# EAGLE design CS_OBC (EAGLE 9.5.0)
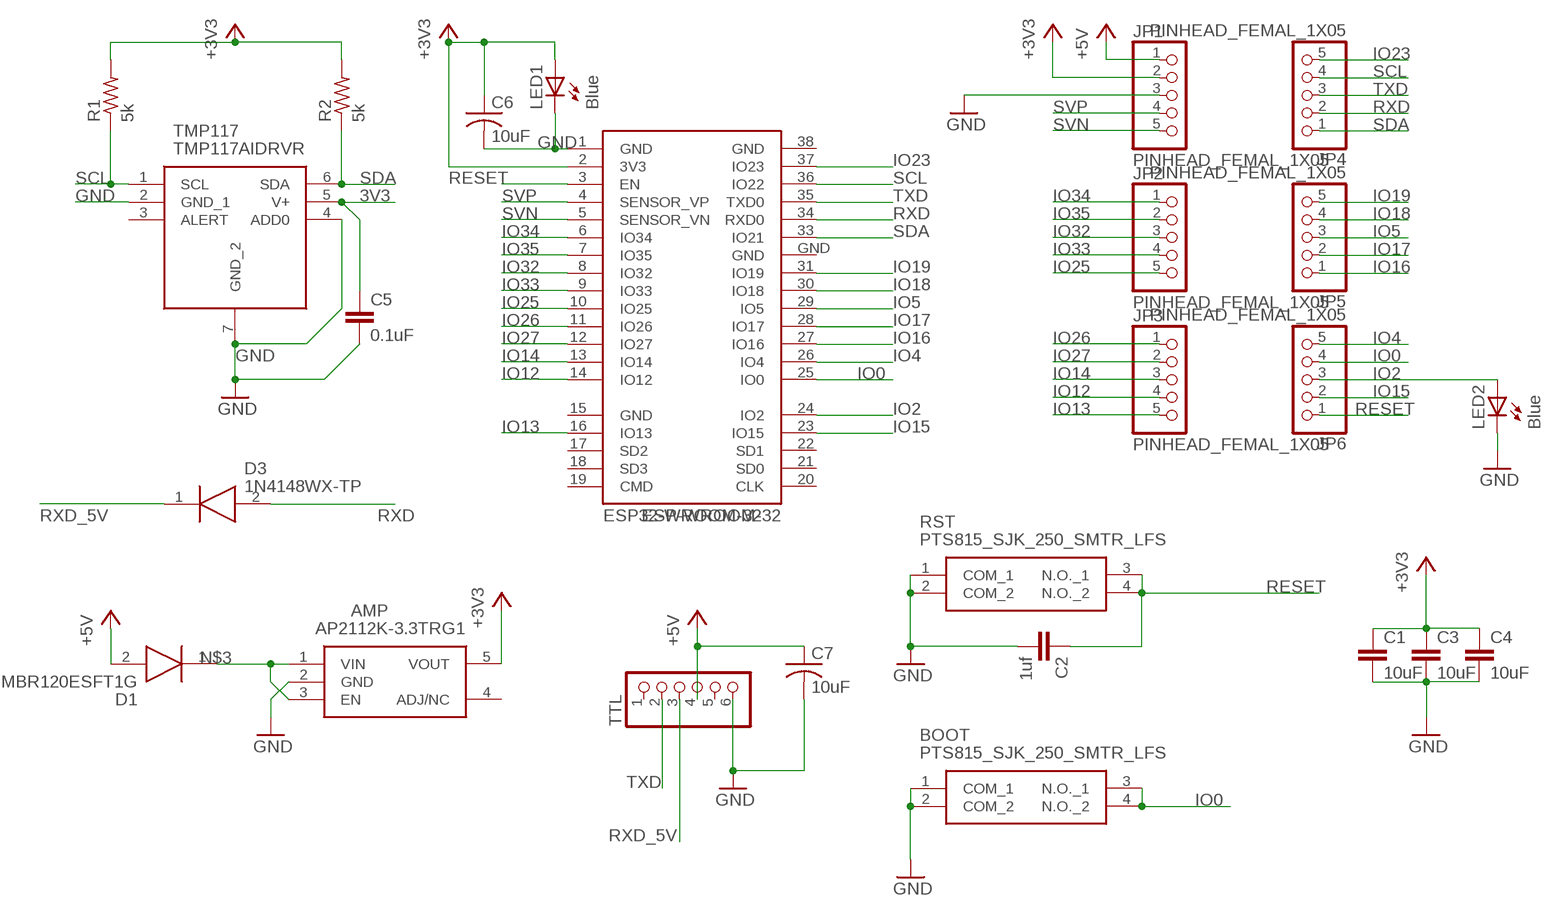
[diagram p0: schematic, sheet 1]

## Parts
AMP  AP2112K-3.3TRG1  [SOT95P282X130-5N]
BOOT  PTS815_SJK_250_SMTR_LFS  [PTS815SJK250SMTRLFS]
C1  10uF  C-EUC0805  [C0805]
C2  1uf  C-EUC0805  [C0805]
C3  10uF  C-EUC0805  [C0805]
C4  10uF  C-EUC0805  [C0805]
C5  0.1uF  C-EUC0805  [C0805]
C6  10uF  C-USC1206  [C1206]
C7  10uF  C-USC1206  [C1206]
D1  MBR120ESFT1G  [SODFL3616X98N]
D3  1N4148WX-TP  [SOD2512X115N]
ESP32-WROOM-32  ESP-WROOM-32  [ESP-WROOM-32]
JP1  PINHEAD_FEMAL_1X05  [1X05F]
JP2  PINHEAD_FEMAL_1X05  [1X05F]
JP3  PINHEAD_FEMAL_1X05  [1X05F]
JP4  PINHEAD_FEMAL_1X05  [1X05F]
JP5  PINHEAD_FEMAL_1X05  [1X05F]
JP6  PINHEAD_FEMAL_1X05  [1X05F]
LED1  Blue  LEDCHIPLED_0805  [CHIPLED_0805]
LED2  Blue  LEDCHIPLED_0805  [CHIPLED_0805]
R1  5k  R-US_R0805  [R0805]
R2  5k  R-US_R0805  [R0805]
RST  PTS815_SJK_250_SMTR_LFS  [PTS815SJK250SMTRLFS]
TMP117  TMP117AIDRVR  [SON65P200X200X80-7N]
TTL  PINHD-1X6/90  [1X06/90]

## Nets
3V3: C5.1 TMP117.5(V+)
+3V3: AMP.5(VOUT) C1.1 C3.1 C4.1 C6.1 ESP32-WROOM-32.2(3V3) JP1.2 LED1.A R1.2 R2.2
+5V: C7.1 D1.2(A) JP1.1 TTL.4
GND: AMP.2(GND) BOOT.1(COM_1) BOOT.2(COM_2) C1.2 C2.2 C3.2 C4.2 C5.2 C6.2 C7.2 ESP32-WROOM-32.1(GND) JP1.3 LED1.C LED2.C RST.1(COM_1) RST.2(COM_2) TMP117.2(GND_1) TMP117.4(ADD0) TMP117.7(GND_2) TTL.6
IO0: BOOT.3(N.O._1) BOOT.4(N.O._2) ESP32-WROOM-32.25(IO0) JP6.4
IO2: ESP32-WROOM-32.24(IO2) JP6.3 LED2.A
IO4: ESP32-WROOM-32.26(IO4) JP6.5
IO5: ESP32-WROOM-32.29(IO5) JP5.3
IO12: ESP32-WROOM-32.14(IO12) JP3.4
IO13: ESP32-WROOM-32.16(IO13) JP3.5
IO14: ESP32-WROOM-32.13(IO14) JP3.3
IO15: ESP32-WROOM-32.23(IO15) JP6.2
IO16: ESP32-WROOM-32.27(IO16) JP5.1
IO17: ESP32-WROOM-32.28(IO17) JP5.2
IO18: ESP32-WROOM-32.30(IO18) JP5.4
IO19: ESP32-WROOM-32.31(IO19) JP5.5
IO23: ESP32-WROOM-32.37(IO23) JP4.5
IO25: ESP32-WROOM-32.10(IO25) JP2.5
IO26: ESP32-WROOM-32.11(IO26) JP3.1
IO27: ESP32-WROOM-32.12(IO27) JP3.2
IO32: ESP32-WROOM-32.8(IO32) JP2.3
IO33: ESP32-WROOM-32.9(IO33) JP2.4
IO34: ESP32-WROOM-32.6(IO34) JP2.1
IO35: ESP32-WROOM-32.7(IO35) JP2.2
N$3: AMP.1(VIN) AMP.3(EN) D1.1(K)
RESET: C2.1 ESP32-WROOM-32.3(EN) JP6.1 RST.3(N.O._1) RST.4(N.O._2)
RXD: D3.2(A) ESP32-WROOM-32.34(RXD0) JP4.2
RXD_5V: D3.1(K) TTL.3
SCL: ESP32-WROOM-32.36(IO22) JP4.4 R1.1 TMP117.1(SCL)
SDA: ESP32-WROOM-32.33(IO21) JP4.1 R2.1 TMP117.6(SDA)
SVN: ESP32-WROOM-32.5(SENSOR_VN) JP1.5
SVP: ESP32-WROOM-32.4(SENSOR_VP) JP1.4
TXD: ESP32-WROOM-32.35(TXD0) JP4.3 TTL.2
Unconnected: AMP.4(ADJ/NC) ESP32-WROOM-32.17(SD2) ESP32-WROOM-32.18(SD3) ESP32-WROOM-32.19(CMD) ESP32-WROOM-32.20(CLK) ESP32-WROOM-32.21(SD0) ESP32-WROOM-32.22(SD1) TMP117.3(ALERT) TTL.1 TTL.5

## Power pins joined to a net without a drawn wire
GND: ESP32-WROOM-32.15(GND) ESP32-WROOM-32.38(GND) ESP32-WROOM-32.GND

## Library data of the parts
AMP = SamacSys_3D:AP2112K-3.3TRG1: 600mA 3.3V LDO Regulator Enable SOT23-5 DiodesZetex AP2112K-3.3TRG1, LDO Voltage Regulator, 3.3 V +/-1.5%, 2.5 6 Vin, 5-Pin SOT-23 Source: Datasheet <http://uk.rs-online.com/web/p/products/8283509>; ALLIED_NUMBER: 70550983; ALLIED_PRICE-STOCK: https://www.alliedelec.com/diodes-inc-ap2112k-3-3trg1/70550983/; DESCRIPTION: 600mA 3.3V LDO Regulator Enable SOT23-5 DiodesZetex AP2112K-3.3TRG1, LDO Voltage Regulator, 3.3 V +/-1.5%, 2.5 6 Vin, 5-Pin SOT-23; HEIGHT: 1.3mm; MANUFACTURER_NAME: Diodes Inc.; MANUFACTURER_PART_NUMBER: AP2112K-3.3TRG1; MOUSER_PART_NUMBER: 621-AP2112K-3.3TRG1; MOUSER_PRICE-STOCK: https://www.mouser.com/Search/Refine.aspx?Keyword=621-AP2112K-3.3TRG1; RS_PART_NUMBER: 8283509P; RS_PRICE-STOCK: http://uk.rs-online.com/web/p/products/8283509P
BOOT RST = SamacSys_3D:PTS815_SJK_250_SMTR_LFS: Tactile Switches Tact Switch, 12 VDC, 50 mA, 4.2x3.2, 2.5mm H, 250gf, J leads Source: Datasheet <https://www.mouser.com/datasheet/2/60/pts815-1535658.pdf>; ALLIED_NUMBER: 71607233; ALLIED_PRICE-STOCK: https://www.alliedelec.com/c-k-pts815sjk250smtrlfs/71607233/; DESCRIPTION: Tactile Switches Tact Switch, 12 VDC, 50 mA, 4.2x3.2, 2.5mm H, 250gf, J leads; HEIGHT: 2mm; MANUFACTURER_NAME: C & K COMPONENTS; MANUFACTURER_PART_NUMBER: PTS815 SJK 250 SMTR LFS; MOUSER_PART_NUMBER: 611-PTS815SJK250SMTR; MOUSER_PRICE-STOCK: https://www.mouser.com/Search/Refine.aspx?Keyword=611-PTS815SJK250SMTR
C1-C5 = rcl:C-EU: CAPACITOR, European symbol; SPICEPREFIX: C
C6 C7 = rcl:C-US: CAPACITOR, American symbol; SPICEPREFIX: C
D1 = SamacSys_3D:MBR120ESFT1G: Source: Datasheet <http://www.onsemi.com/pub/Collateral/MBR120ESFT1-D.PDF>; ALLIED_NUMBER: 70339890; ALLIED_PRICE-STOCK: http://www.alliedelec.com/on-semiconductor-mbr120esft1g/70339890/; HEIGHT: 0.98mm; MANUFACTURER_NAME: ON Semiconductor; MANUFACTURER_PART_NUMBER: MBR120ESFT1G; MOUSER_PART_NUMBER: 863-MBR120ESFT1G; MOUSER_PRICE-STOCK: https://www.mouser.com/Search/Refine.aspx?Keyword=863-MBR120ESFT1G; RS_PART_NUMBER: 7925606P; RS_PRICE-STOCK: http://uk.rs-online.com/web/p/products/7925606P
D3 = SamacSys_3D:1N4148WX-TP: MICRO COMMERCIAL COMPONENTS - 1N4148WX-TP - SWITCHING DIODE, 500MW, 1V, SOD323 Source: Datasheet <https://componentsearchengine.com/Datasheets/2/1N4148WX-TP.pdf>; DESCRIPTION: MICRO COMMERCIAL COMPONENTS - 1N4148WX-TP - SWITCHING DIODE, 500MW, 1V, SOD323; HEIGHT: 1.15mm; MANUFACTURER_NAME: Micro Commercial Components (MCC); MANUFACTURER_PART_NUMBER: 1N4148WX-TP; MOUSER_PART_NUMBER: 833-1N4148WX-TP; MOUSER_PRICE-STOCK: https://www.mouser.com/Search/Refine.aspx?Keyword=833-1N4148WX-TP
ESP32-WROOM-32 = esp32:ESP-WROOM-32: Espressif Systems ESP-WROOM-32
JP1-JP6 = SamacSys_3D:PINHEAD_FEMAL_1X05
LED1 LED2 = adafruit:LED: LED OSRAM: - CHIPLED LG R971, LG N971, LY N971, LG Q971, LY Q971, LO R971, LY R971 LH N974, LH R974 LS Q976, LO Q976, LY Q976 LO Q996 - Hyper CHIPLED LW Q18S LB Q993, LB Q99A, LB R99A - SideLED LS A670, LO A670, LY A670, LG A670, LP A670 LB A673, LV A673, LT A673, LW A673 LH A674 LY A675 LS A676, LA A676, LO A676, LY A676, LW A676 LS A679, LY A679, LG A679 - Hyper Micro SIDELED® LS Y876, LA Y876, LO Y876, LY Y876 LT Y87S - SmartLED LW L88C, LW L88S LB L89C, LB L89S, LG L890 LS L89K, LO L89K, LY L89K LS L896, LA L896, LO L896, LY L896 - TOPLED LS T670, LO T670, LY T670, LG T670, LP T670 LSG T670, LSP T670, LSY T670, LOP T670, LYG T670 LG T671, LOG T671, LSG T671 LB T673, LV T673, LT T673, LW T673 LH T674 LS T676, LA T676, LO T676, LY T676, LB T676, LH T676, LSB T676, LW T676 LB T67C, LV T67C, LT T67C, LS T67K, LO T67K, LY T67K, LW E67C LS E67B, LA E67B, LO E67B, LY E67B, LB E67C, LV E67C, LT E67C LW T67C LS T679, LY T679, LG T679 LS T770, LO T770, LY T770, LG T770, LP T770 LB T773, LV T773, LT T773, LW T773 LH T774 LS E675, LA E675, LY E675, LS T675 LS T776, LA T776, LO T776, LY T776, LB T776 LHGB T686 LT T68C, LB T68C - Hyper Mini TOPLED® LB M676 - Mini TOPLED Santana® LG M470 LS M47K, LO M47K, LY M47K Source: http://www.osram.convergy.de/
R1 R2 = rcl:R-US_: RESISTOR, American symbol; SPICEPREFIX: R
TMP117 = SamacSys_3D:TMP117AIDRVR: +/-0.1C Accurate Digital Temperature Sensor with Integrated NV Memory Source: Datasheet <http://www.ti.com/lit/gpn/tmp117>; DESCRIPTION: +/-0.1C Accurate Digital Temperature Sensor with Integrated NV Memory; HEIGHT: 0.8mm; MANUFACTURER_NAME: Texas Instruments; MANUFACTURER_PART_NUMBER: TMP117AIDRVR; MOUSER_PART_NUMBER: 595-TMP117AIDRVR; MOUSER_PRICE-STOCK: https://www.mouser.com/Search/Refine.aspx?Keyword=595-TMP117AIDRVR; SPICEPREFIX: X
TTL = pinhead:PINHD-1X6: PIN HEADER

## Board
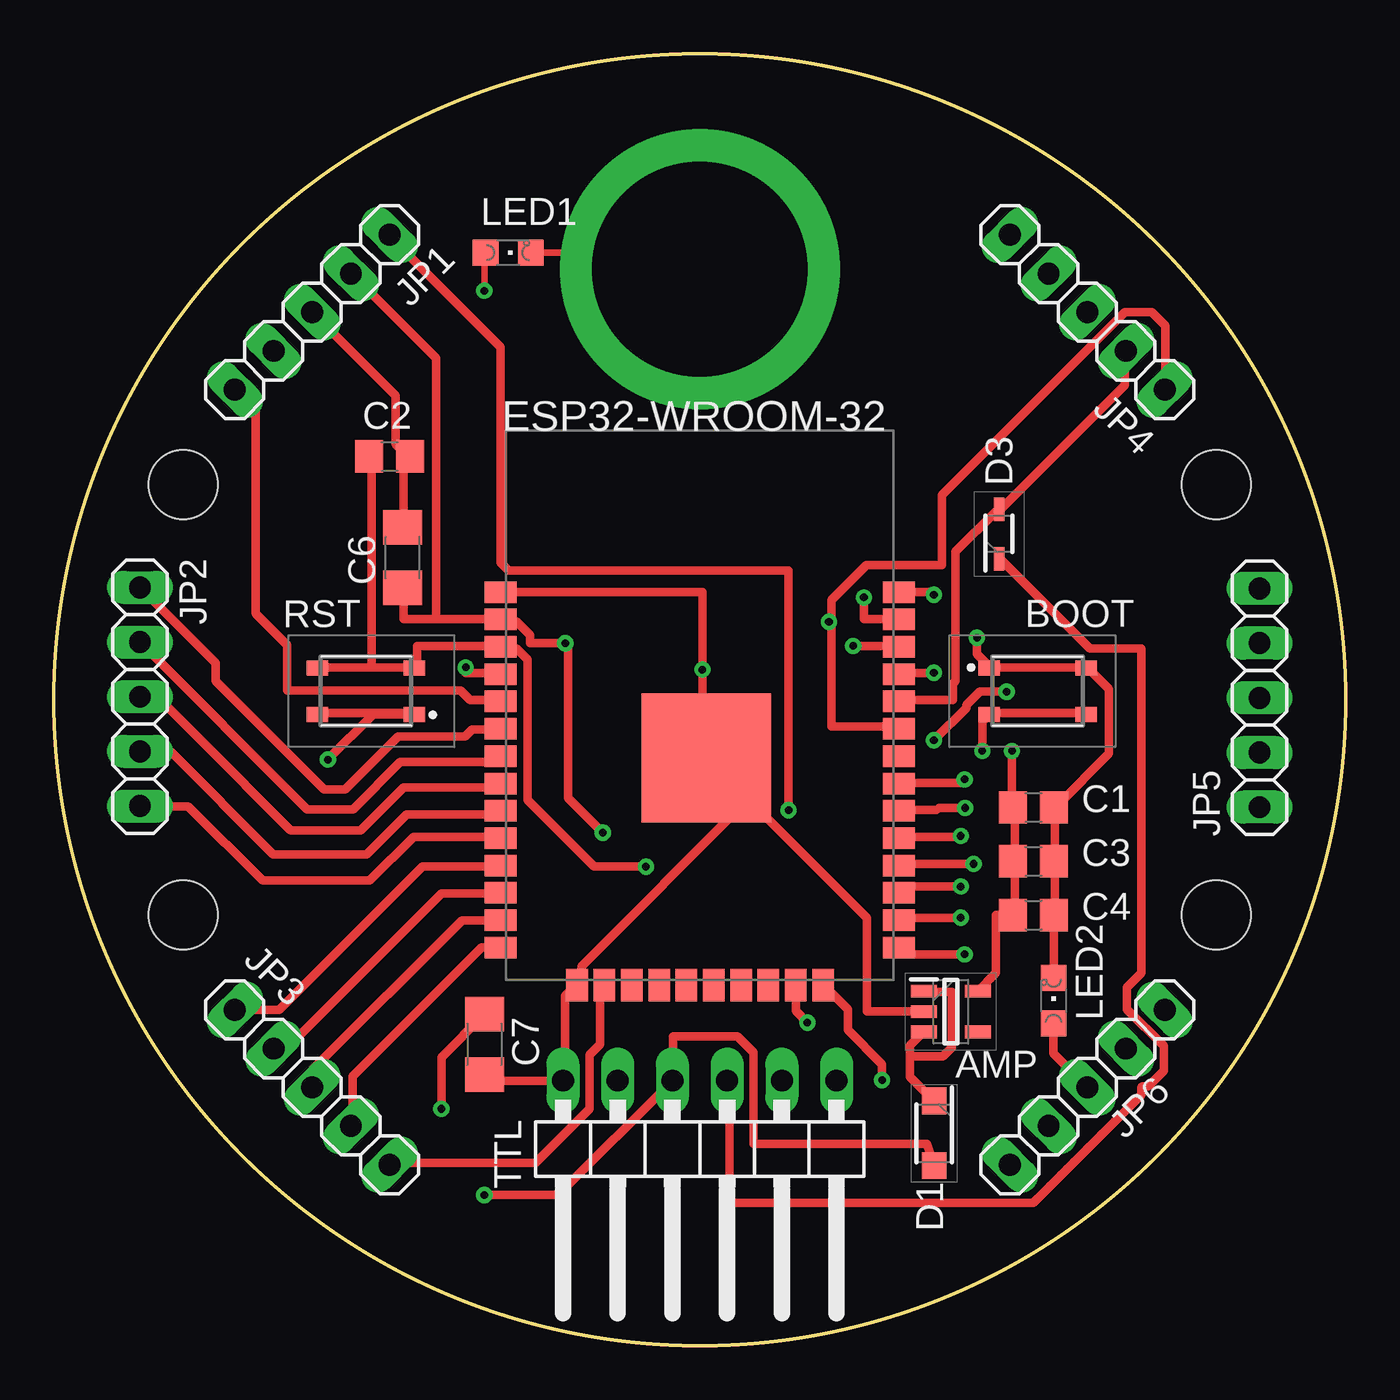
[diagram p1: board, top side]
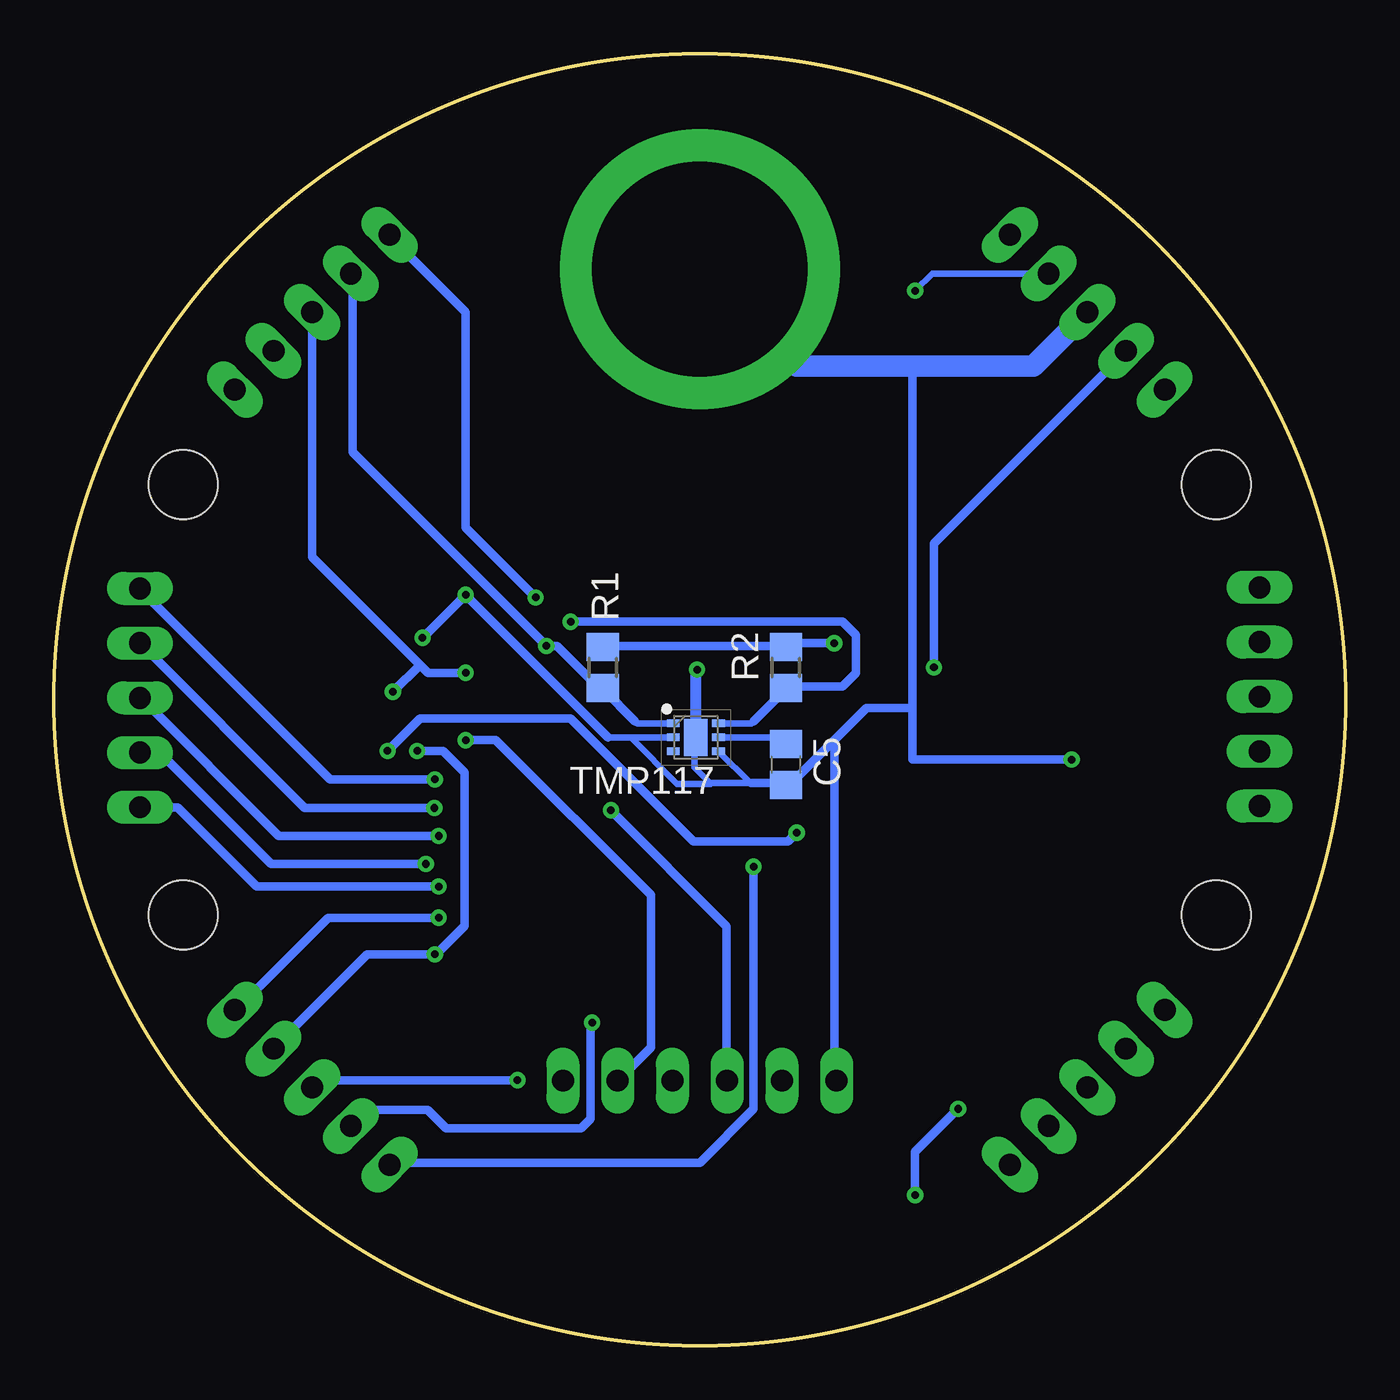
[diagram p2: board, bottom side, seen from below]

Size 60 x 60 mm. Coordinates in mm from the lower left corner, seen from the top.
Outline: circle at 30,30 radius 30
Outline: circle at 30,30 radius 30
Outline: circle at 30,30 radius 30
Copper layers (1*16): Top 0.035mm / dielectric 1.5mm / Bottom 0.035mm
Design rules "CanSat *": minimum track width 0.3mm, minimum drill 0.35mm, track to track 8mil, track to pad 10mil, pad to pad 8mil, via to via 15mil, smd to smd 6mil, copper to edge 1.5mm, drill to drill 10mil, minimum pad ring 10mil, minimum via ring 8mil, stop-mask expansion 6mil, vias tented up to drill 0mil, thermal gap 8mil
Holes 3.2 mm at 6,40 6,20 54,20 54,40

### Footprints (pad centres in the part's own frame; a part is rotated, then mirrored left to right if it is on the bottom)
SOT95P282X130-5N = smd 1.2 x 0.6: 1 -1.25,0.95; 2 -1.25,0; 3 -1.25,-0.95; 4 1.25,-0.95; 5 1.25,0.95
PTS815SJK250SMTRLFS = smd 1 x 0.7: 1 -2.25,1.075; 2 2.25,1.075; 3 -2.25,-1.075; 4 2.25,-1.075
C0805 = smd 1.3 x 1.5: 1 -0.95,0; 2 0.95,0
C1206 = smd 1.6 x 1.8: 1 -1.4,0; 2 1.4,0
SODFL3616X98N = smd 1.24 x 1.12: 1 -1.5,0; 2 1.5,0
SOD2512X115N = smd 1.1 x 0.5: 1 -1.15,0; 2 1.15,0
ESP-WROOM-32 = smd 1.5 x 1: 1 -9.25,7; 2 -9.25,5.73; 3 -9.25,4.46; 4 -9.25,3.19; 5 -9.25,1.92; 6 -9.25,0.65; 7 -9.25,-0.62; 8 -9.25,-1.89; 9 -9.25,-3.16; 10 -9.25,-4.43; 11 -9.25,-5.7; 12 -9.25,-6.97; 13 -9.25,-8.24; 14 -9.25,-9.51; 25 9.25,-9.51; 26 9.25,-8.24; 27 9.25,-6.97; 28 9.25,-5.7; 29 9.25,-4.43; 30 9.25,-3.16; 31 9.25,-1.89; 32 9.25,-0.62; 33 9.25,0.65; 34 9.25,1.92; 35 9.25,3.19; 36 9.25,4.46; 37 9.25,5.73; 38 9.25,7 | smd 1 x 1.5: 15 -5.7,-11.25; 16 -4.43,-11.25; 17 -3.16,-11.25; 18 -1.89,-11.25; 19 -0.62,-11.25; 20 0.65,-11.25; 21 1.92,-11.25; 22 3.19,-11.25; 23 4.46,-11.25; 24 5.73,-11.25 | smd 6 x 6: GND 0.3,-0.7
1X05F = drill 1.016 long: 1 -5.08,0; 2 -2.54,0; 3 0,0; 4 2.54,0; 5 5.08,0
CHIPLED_0805 = smd 1.2 x 1.2: A 0,-1.05; C 0,1.05
R0805 = smd 1.3 x 1.5: 1 -0.95,0; 2 0.95,0
SON65P200X200X80-7N = smd 0.6 x 0.35: 1 -1.05,0.65; 2 -1.05,0; 3 -1.05,-0.65; 4 1.05,-0.65; 5 1.05,0; 6 1.05,0.65 | smd 1.1 x 1.7: 7 0,0
1X06/90 = drill 1.016 long: 1 -6.35,-3.81; 2 -3.81,-3.81; 3 -1.27,-3.81; 4 1.27,-3.81; 5 3.81,-3.81; 6 6.35,-3.81

### Placement (x,y rotation side)
AMP  41.66,15.52 0 top
BOOT  45.7,30.4 0 top
C1  45.5,25 0 top
C2  15.6,41.3 0 top
C3  45.5,22.5 0 top
C4  45.5,20 0 top
C5  26,27 270 bottom
C6  16.2,36.6 90 top
C7  20,14 270 top
D1  40.89,9.87 270 top
D3  43.9,37.7 90 top
ESP32-WROOM-32  30,28 0 top
JP1  12,48 225 top
JP2  4,30.14 270 top
JP3  12,12 315 top
JP4  48,48 135 top
JP5  56,30.09 90 top
JP6  48,12 45 top
LED1  21.1,50.77 270 top
LED2  46.43,16.02 0 top
R1  34.5,31.5 90 bottom
R2  26,31.5 90 bottom
RST  14.5,30.4 180 top
TMP117  30.18,28.25 0 bottom
TTL  30,8.5 180 top

### Tracks (layer width: path | path; a pad name or v marks a point on that pad's centre or on a via)
3V3
  Bottom 0.3: C5.1 26.3,28.25 TMP117.5
  Bottom 0.4: 26,28 C5.1
+3V3  (via drill 0.35)
  Top 0.3: v20,49 20,50.71 LED1.A
  Top 0.4: AMP.5 43.76,17.31 43.76,20 C4.1 44.62,20.12 44.62,22.5 C3.1 44.62,22.62 44.62,25 C1.1 44.5,25.12 v44.5,27.62 | 17.75,33.75 16.25,33.75 16.25,35.12 C6.1 | 17.75,33.75 20.75,33.75 ESP32-WROOM-32.2 20.88,33.62 21.5,33.62 22.12,33 22.12,32.62 v23.75,32.62 23.88,32.5 23.88,25.45 v25.5,23.82 | 17.75,33.75 17.75,45.88 13.88,49.75 JP1.2
  Bottom 0.3: JP1.2 19.2,49.8 v20,49
  Bottom 0.4: R1.2 34.5,32.5 26,32.5 R2.2 25.88,32.62 v23.75,32.62 | v44.5,27.62 43,29.12 36,29.12 30.3,23.43 25.9,23.43 v25.5,23.82
+5V  (via drill 0.35)
  Top 0.4: D1.2 40.55,9.38 32.5,9.38 32.5,13.62 31.75,14.38 28.75,14.38 28.75,12.38 TTL.4 23.42,7 v20,7 | v34.12,24.88 34.12,36 21.12,36 20.75,36.38 20.75,46.38 15.62,51.5 JP1.1 | v18,11 18,13.4 C7.1
  Bottom 0.4: v34.12,24.88 34.12,24.85 28.75,19.48 28.75,12.38 TTL.4 | v20,7 20,9 v18,11
GND  (via drill 0.35, 10 pad 13)
  Top 0.3: LED1.C 29.23,50.77 v30,50
  Top 0.4: AMP.2 37.76,15.53 37.76,19.87 30.38,27.25 ESP32-WROOM-32.GND | ESP32-WROOM-32.1 30.12,35 v30.12,31.4 30.12,27.38 ESP32-WROOM-32.GND | ESP32-WROOM-32.GND 32.12,25.25 24.5,17.62 24.5,17 24.38,16.88 ESP32-WROOM-32.15 24.25,16.75 23.75,16.25 23.75,12.38 TTL.6 20.29,12.31 C7.2 | C6.2 16.25,38 16.25,41 C2.2 16.38,41.38 15.88,41.88 15.88,44.12 JP1.3 | RST.2 12.25,29.38 16.75,29.38 RST.1 14.82,29.32 v12.73,27.23 | ESP32-WROOM-32.38 40.88,35 v40.88,34.88 | v42.88,32.88 42.88,32.12 43.38,31.62 BOOT.1 43.5,31.5 47.88,31.5 BOOT.2 48.12,31.38 49,30.5 49,27.5 46.62,25.12 C1.2 46.5,25 46.5,22.62 C3.2 46.5,22.5 46.5,20 C4.2 46.45,17.09 LED2.C
  Bottom 0.3: TMP117.2 33.2,28.25 | 33.2,28.25 34.25,28.25 | 27.62,26.12 27.66,26.12 | 27.66,26.12 TMP117.4 | 27.66,26.12 29.52,26.12 | 30.25,28.25 30.25,26.85 29.52,26.12 | 29.52,26.12 29.5,26.1 31.05,26.1 33.2,28.25
  Bottom 0.4: 30.25,28.25 TMP117.7 | 27.62,26.12 26,26.12 C5.2 25.88,26 23.88,28 | 34.25,28.25 v40.88,34.88 v42.88,32.88 | 20.12,29.62 22.25,29.62 23.88,28 | v12.73,27.23 20.12,27.23 20.12,29.62 | 20.12,29.62 20.12,45.5 | TTL.6 23.75,12.38 23.75,27.88 23.88,28
  Bottom 0.5: TMP117.7 30.18,31.34 v30.12,31.4
  Bottom 1: JP1.3 14.5,45.5 20.12,45.5 25.5,45.5 v30,50
IO0  (via drill 0.35)
  Top 0.4: BOOT.4 47.88,29.38 43.5,29.38 BOOT.3 43.12,29 v43.12,27.62 | v42.3,18.18 39.25,18.18 ESP32-WROOM-32.25
  Bottom 0.4: JP6.4 49.75,13.88 45.45,18.18 v42.3,18.18 42.25,18.18 40.92,19.5 40.92,26.62 41.92,27.62 v43.12,27.62
IO2  (via drill 0.35)
  Top 0.4: v38.46,12.33 38.46,13.08 36.88,14.66 36.88,15.62 35.75,16.75 ESP32-WROOM-32.24 | LED2.A 46.44,13.57 JP6.3
  Bottom 0.4: v38.46,12.33 47.67,12.33 JP6.3
IO4  (via drill 0.35)
  Top 0.4: v42.12,19.88 39.25,19.88 ESP32-WROOM-32.26
  Bottom 0.4: v42.12,19.88 47.25,19.88 51.5,15.62 JP6.5
IO5  (via drill 0.35)
  Top 0.4: v42.12,23.68 42.12,23.62 39.25,23.62 ESP32-WROOM-32.29
  Bottom 0.4: v42.12,23.68 49.55,23.68 56,30.12 JP5.3
IO12
  Top 0.4: ESP32-WROOM-32.14 19.87,18.49 13.88,12.5 13.88,10.25 JP3.4
IO13
  Top 0.4: ESP32-WROOM-32.16 25.5,16.75 25.38,16.62 25.38,14 24.88,13.5 24.88,11 22.38,8.5 15.62,8.5 JP3.5
IO14
  Top 0.4: JP3.3 12,12.8 18.95,19.75 ESP32-WROOM-32.13
IO15  (via drill 0.35)
  Top 0.4: v35,15 34.46,15.54 ESP32-WROOM-32.23 | ESP32-WROOM-32.23 34.71,16.5 34.75,16.5 | 34.5,16.75 ESP32-WROOM-32.23
  Bottom 0.4: v35,15 35.08,14.92 35.08,10.53 35.51,10.1 41.78,10.1 42.64,10.96 45.45,10.96 JP6.2
IO16  (via drill 0.35)
  Top 0.4: v42.12,21.32 39.25,21.32 ESP32-WROOM-32.27
  Bottom 0.4: v42.12,21.32 50.58,21.32 54.25,25 JP5.1
IO17  (via drill 0.35)
  Top 0.4: v42.73,22.38 39.25,22.38 ESP32-WROOM-32.28
  Bottom 0.4: v42.73,22.38 49.91,22.38 55.05,27.52 55.97,27.52 JP5.2
IO18  (via drill 0.35)
  Top 0.4: v42.33,24.98 41.1,24.98 41,24.88 39.25,24.88 ESP32-WROOM-32.30
  Bottom 0.4: v42.33,24.98 48.35,24.98 JP5.4
IO19  (via drill 0.35)
  Top 0.4: v42.3,26.3 42.3,26.12 39.25,26.12 ESP32-WROOM-32.31
  Bottom 0.4: v42.3,26.3 47.17,26.3 56,35.12 JP5.5
IO23  (via drill 0.35)
  Top 0.4: v37.62,34.75 37.62,33.75 39.25,33.75 ESP32-WROOM-32.37
  Bottom 0.4: v37.62,34.75 40.88,38 40.88,48 44.38,51.5 JP4.5
IO25
  Top 0.4: JP2.5 6.24,25.05 9.69,21.6 14.68,21.6 16.7,23.62 20.75,23.62 ESP32-WROOM-32.10
IO26
  Top 0.4: JP3.1 10.47,15.59 17.12,22.25 20.75,22.25 ESP32-WROOM-32.11
IO27
  Top 0.4: ESP32-WROOM-32.12 20.75,21 18,21 10.8,13.8 JP3.2
IO32
  Top 0.4: ESP32-WROOM-32.8 20.56,25.93 16.24,25.93 14.24,23.93 11,23.93 8.86,26.06 8.88,26.06 4.8,30.14 JP2.3
IO33
  Top 0.4: ESP32-WROOM-32.9 20.59,24.68 16.39,24.68 14.54,22.83 10.19,22.83 5.42,27.6 JP2.4
IO34
  Top 0.4: ESP32-WROOM-32.6 20.75,28.62 19.43,28.62 19.1,28.3 16,28.3 13.53,25.83 12.56,25.83 7.51,30.88 7.51,31.7 4,35.21 JP2.1
IO35
  Top 0.4: ESP32-WROOM-32.7 20.47,27.1 16.09,27.1 13.89,24.9 11.77,24.9 JP2.2
N$3
  Top 0.4: D1.1 39.76,12.49 39.76,13.44 | 39.76,13.44 39.76,13.94 40.39,14.56 AMP.3 | AMP.1 40.51,16.44 41.71,16.44 41.71,13.86 41.29,13.44 39.76,13.44
RESET  (via drill 0.35)
  Top 0.4: 14.75,31.5 16.75,31.5 RST.3 16.88,31.62 16.88,32.5 20.75,32.5 ESP32-WROOM-32.3 20.88,32.38 21.5,32.38 22,31.88 22,25.35 25.1,22.25 v27.5,22.25 | 14.75,31.5 12.25,31.5 RST.4 | 14.75,31.5 14.75,41.25 C2.1
  Bottom 0.4: v27.5,22.25 27.5,11 30,8.5 44.38,8.5 JP6.1
RXD
  Top 0.4: JP4.2 49.75,46.12 49.75,44.62 44,38.88 D3.2 43.75,38.75 41.88,36.88 41.88,30.88 41.75,30.75 41.75,30 39.25,30 ESP32-WROOM-32.34
RXD_5V
  Top 0.4: D3.1 44,36.5 48.12,32.38 50.52,32.38 50.52,17.32 49.84,16.63 49.84,15.63 51.55,13.91 51.55,12.75 50.84,12.04 50.56,12.04 50.52,12 50.52,11.64 45.5,6.62 31.38,6.62 31.38,12.25 TTL.3
SCL  (via drill 0.35)
  Top 0.4: v37.12,32.5 39.25,32.5 ESP32-WROOM-32.36
  Bottom 0.3: 33,29 32.9,28.9 TMP117.1
  Bottom 0.4: 33,29 34.5,30.5 R1.1 34.62,30.5 36.62,32.5 v37.12,32.5 46.12,41.5 46.12,49.75 JP4.4
SDA  (via drill 0.35)
  Top 0.4: 36.12,33.62 36.12,34.62 37.75,36.25 41.25,36.25 41.25,39.5 49.75,48 51,48 51.62,47.38 51.62,44.5 JP4.1 | 36.12,33.62 36.12,28.75 39.25,28.75 ESP32-WROOM-32.33 | v36,33.62 36.12,33.62
  Bottom 0.3: 27.5,29 27.6,28.9 TMP117.6
  Bottom 0.4: 27.5,29 26,30.5 R2.1 25.88,30.62 23.38,30.62 22.75,31.25 22.75,33 23.38,33.62 v36,33.62
SVN
  Top 0.4: ESP32-WROOM-32.5 20.75,30 19.32,30 18.9,30.42 10.83,30.42 10.83,32.55 9.38,34 9.38,43.5 8.5,44.38 JP1.5
SVP  (via drill 0.35)
  Top 0.4: v19.12,31.5 19.12,31.25 20.75,31.25 ESP32-WROOM-32.4
  Bottom 0.4: v19.12,31.5 19.12,37.25 10.25,46.12 JP1.4
TXD  (via drill 0.35)
  Top 0.4: v40.88,31.25 39.25,31.25 ESP32-WROOM-32.35 | v40.88,28.12 42.38,29.62 42.38,29.75 43,30.38 v44.25,30.38
  Bottom 0.4: v40.88,31.25 42.62,31.25 43,31.62 | 43,31.62 48,36.62 JP4.3 | TTL.2 32.27,13.84 32.27,20.93 39.48,28.12 v40.88,28.12 | 43,31.62 v44.25,30.38